# EAGLE design 0_8mm_Layers (EAGLE 9.5.2)
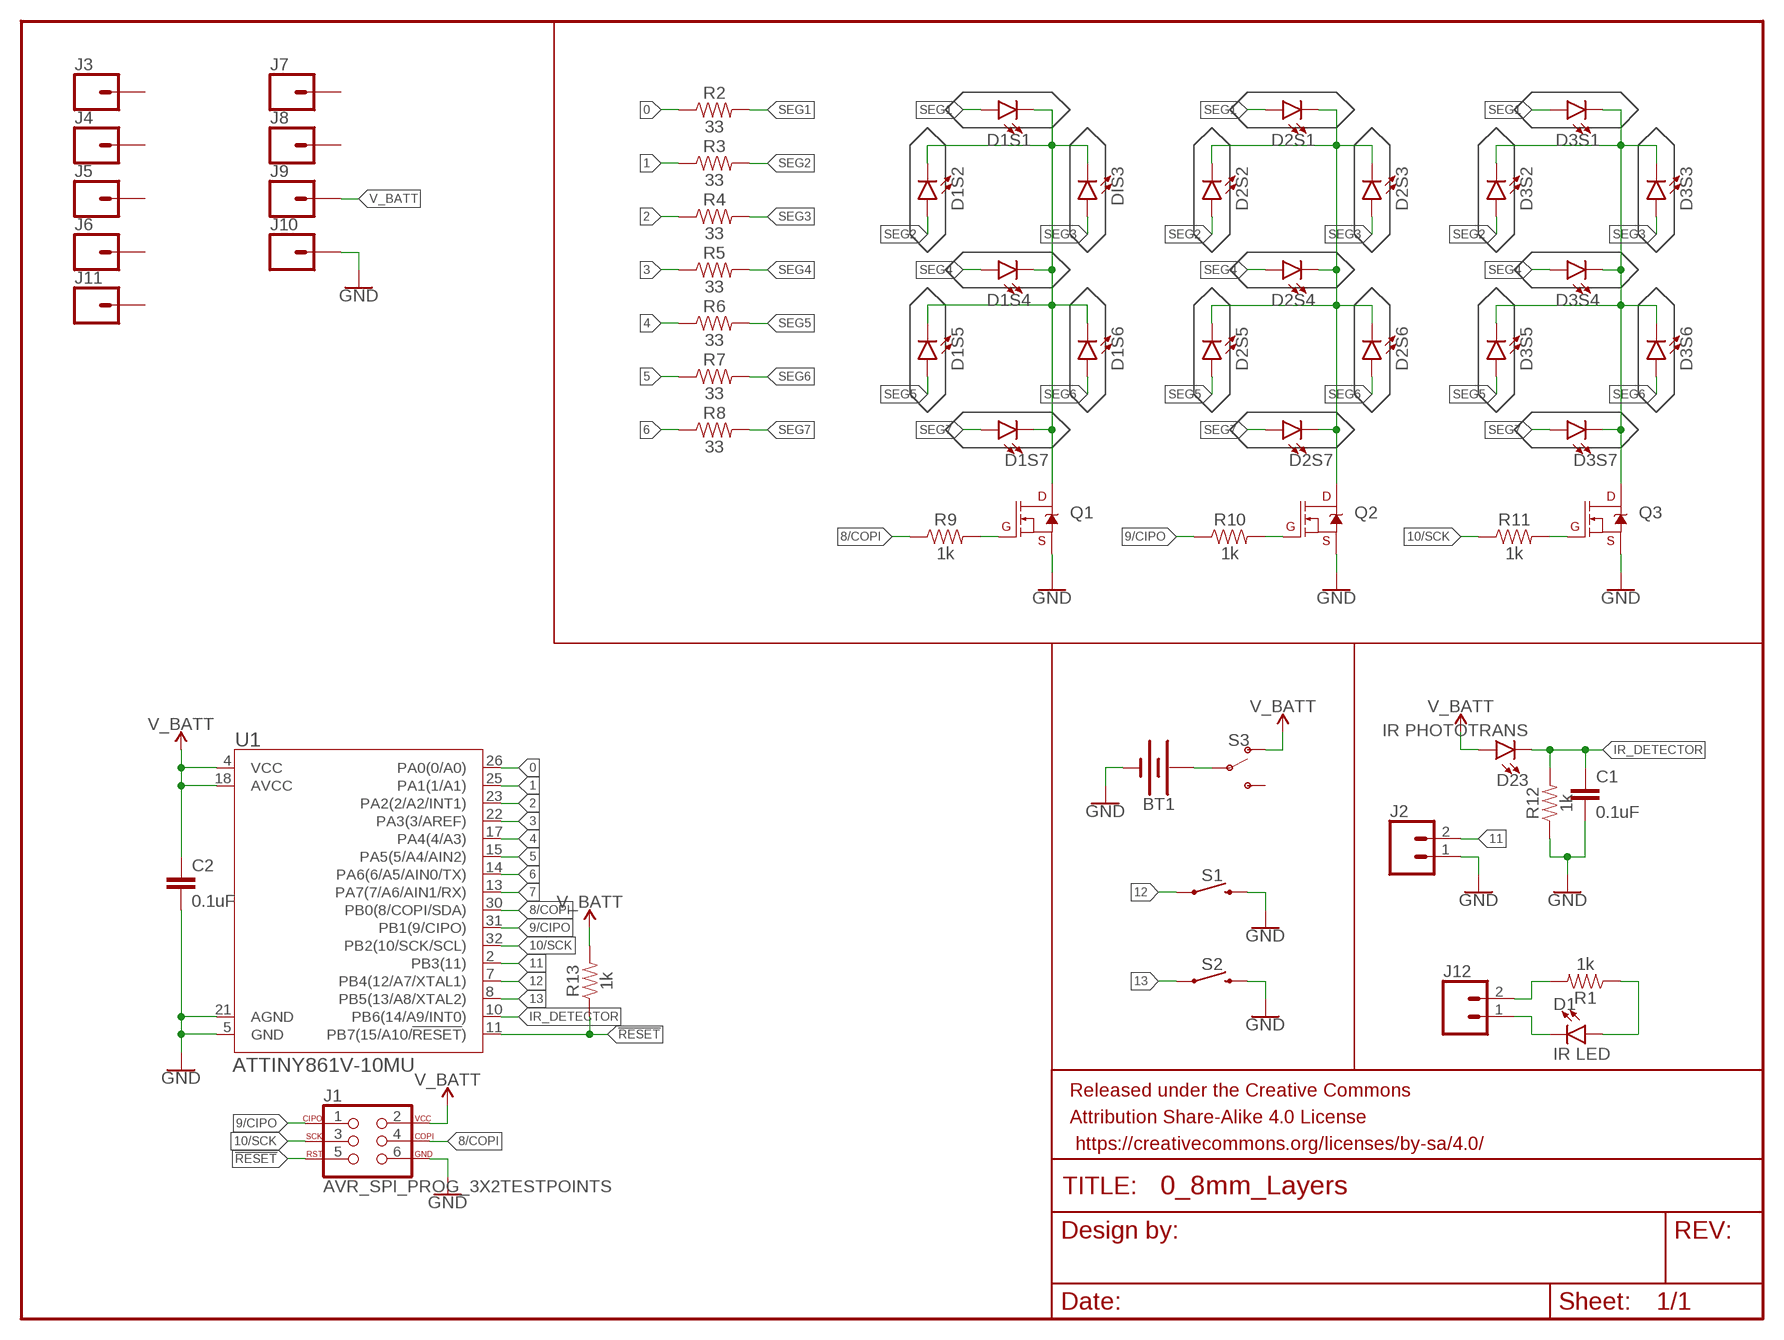
[diagram p0: schematic, sheet 1]

## Parts
BT1  BATTERY-20MM_SMD_4LEGS_OVERPASTE_INNER  [BATTCON_20MM_4LEGS_OVERPASTE_INNER]
C1  0.1uF  0.1UF-0603-25V-(+80/-20%)  [0603]
C2  0.1uF  0.1UF-0603-25V-(+80/-20%)  [0603]
D1  IR LED  LED-IR0603  [LED-0603]
D1S1  LED0603  [LED-0603]
D1S2  LED0603  [LED-0603]
D1S4  LED0603  [LED-0603]
D1S5  LED0603  [LED-0603]
D1S6  LED0603  [LED-0603]
D1S7  LED0603  [LED-0603]
D2S1  LED0603  [LED-0603]
D2S2  LED0603  [LED-0603]
D2S3  LED0603  [LED-0603]
D2S4  LED0603  [LED-0603]
D2S5  LED0603  [LED-0603]
D2S6  LED0603  [LED-0603]
D2S7  LED0603  [LED-0603]
D3S1  LED0603  [LED-0603]
D3S2  LED0603  [LED-0603]
D3S3  LED0603  [LED-0603]
D3S4  LED0603  [LED-0603]
D3S5  LED0603  [LED-0603]
D3S6  LED0603  [LED-0603]
D3S7  LED0603  [LED-0603]
D23  IR PHOTOTRANS  LED-IR0603  [LED-0603]
DIS3  LED0603  [LED-0603]
FRAME1  FRAME-LETTER  [CREATIVE_COMMONS]
J1  AVR_SPI_PROG_3X2TESTPOINTS  [2X3_TEST_POINTS]
J2  CONN_02  [1X02]
J3  CONN_01  [1X01]
J4  CONN_01  [1X01]
J5  CONN_01  [1X01]
J6  CONN_01  [1X01]
J7  CONN_01  [1X01]
J8  CONN_01  [1X01]
J9  CONN_01  [1X01]
J10  CONN_01  [1X01]
J11  CONN_01  [1X01]
J12  CONN_02  [1X02]
Q1  220mA/50V/3.5Ω  MOSFET-NCH-BSS138  [SOT23-3]
Q2  220mA/50V/3.5Ω  MOSFET-NCH-BSS138  [SOT23-3]
Q3  220mA/50V/3.5Ω  MOSFET-NCH-BSS138  [SOT23-3]
R1  1k  1KOHM-0603-1/10W-1%  [0603]
R2  33  33OHM-0603-1/10W-1%  [0603]
R3  33  33OHM-0603-1/10W-1%  [0603]
R4  33  33OHM-0603-1/10W-1%  [0603]
R5  33  33OHM-0603-1/10W-1%  [0603]
R6  33  33OHM-0603-1/10W-1%  [0603]
R7  33  33OHM-0603-1/10W-1%  [0603]
R8  33  33OHM-0603-1/10W-1%  [0603]
R9  1k  1KOHM-0603-1/10W-1%  [0603]
R10  1k  1KOHM-0603-1/10W-1%  [0603]
R11  1k  1KOHM-0603-1/10W-1%  [0603]
R12  1k  1KOHM-0603-1/10W-1%  [0603]
R13  1k  1KOHM-0603-1/10W-1%  [0603]
S1  MOMENTARY-SWITCH-SPST-SMD-5.2MM-TALL  [TACTILE_SWITCH_SMD_5.2MM]
S2  MOMENTARY-SWITCH-SPST-SMD-5.2MM-TALL  [TACTILE_SWITCH_SMD_5.2MM]
S3  SWITCH-SPDT-SMD-RIGHT-ANGLE  [SWITCH_SPST_SMD_A]
U1  ATTINY861V-10MU  [32M1-A_ATM]

## Nets
0: R2.1 U1.26(PA0(0/A0))
1: R3.1 U1.25(PA1(1/A1))
2: R4.1 U1.23(PA2(2/A2/INT1))
3: R5.1 U1.22(PA3(3/AREF))
4: R6.1 U1.17(PA4(4/A3))
5: R7.1 U1.15(PA5(5/A4/AIN2))
6: R8.1 U1.14(PA6(6/A5/AIN0/TX))
7: U1.13(PA7(7/A6/AIN1/RX))
8/COPI: J1.4 R9.1 U1.30(PB0(8/COPI/SDA))
9/CIPO: J1.1 R10.1 U1.31(PB1(9/CIPO))
10/SCK: J1.3 R11.1 U1.32(PB2(10/SCK/SCL))
11: J2.2 U1.2(PB3(11))
12: S1.1 U1.7(PB4(12/A7/XTAL1))
13: S2.1 U1.8(PB5(13/A8/XTAL2))
!RESET: J1.5 R13.1 U1.11(PB7(15/A10/!RESET!))
GND: BT1.2(-) C1.2 C2.2 J1.6 J2.1 J10.1 Q1.2(S) Q2.2(S) Q3.2(S) R12.1 S1.3 S2.3 U1.5(GND) U1.21(AGND)
IR_DETECTOR: C1.1 D23.C R12.2 U1.10(PB6(14/A9/INT0))
N$4: D1S1.C D1S2.C D1S4.C D1S5.C D1S6.C D1S7.C DIS3.C Q1.3(D)
N$6: BT1.1(+) S3.2(P)
N$8: Q2.1(G) R10.2
N$9: Q1.1(G) R9.2
N$11: D2S1.C D2S2.C D2S3.C D2S4.C D2S5.C D2S6.C D2S7.C Q2.3(D)
N$13: Q3.1(G) R11.2
N$14: D3S1.C D3S2.C D3S3.C D3S4.C D3S5.C D3S6.C D3S7.C Q3.3(D)
N$44: J12.2 R1.2
N$45: D1.A R1.1
N$46: D1.C J12.1
SEG1: D1S1.A D2S1.A D3S1.A R2.2
SEG2: D1S2.A D2S2.A D3S2.A R3.2
SEG3: D2S3.A D3S3.A DIS3.A R4.2
SEG4: D1S4.A D2S4.A D3S4.A R5.2
SEG5: D1S5.A D2S5.A D3S5.A R6.2
SEG6: D1S6.A D2S6.A D3S6.A R7.2
SEG7: D1S7.A D2S7.A D3S7.A R8.2
V_BATT: C2.1 D23.A J1.2 J9.1 R13.2 S3.1(O) U1.4(VCC) U1.18(AVCC)
Unconnected: J3.1 J4.1 J5.1 J6.1 J7.1 J8.1 J11.1 S3.3(S)

## Library data of the parts
BT1 = SparkFun-Batteries:BATTERY: Battery - Single Cell A variety of battery chemistries, sizes, and footprints. Device List: 20MM_PTH - Coin Cell Battery Holder - 20mm (PTH) <https://www.sparkfun.com/products/783> 20MM_PTH_KIT- Coin Cell battery Holder - 20 mm (PTH) <http://www.sparkfun.com/products/783>kit version with special mask 6.8MM_PTH - Coin Cell Battery Holder - 6.8MM(SMD) <https://www.digikey.com/product-detail/en/seiko-instruments/MS621FE-FL11E/728-1057-ND/1889208?WT.srch=1&gclid=CNOQ5a6LzdQCFZS2wAodXCkE0g> 12MM_SMD - Coin Cell Battery Holder - 12mm (SMD) <https://www.sparkfun.com/products/10592> 12MM_PTH - Coin Cell Battery Holder - 12mm (PTH) <https://www.sparkfun.com/products/7948> 20MM_SMD - 20mm Coin Cell Battery Holder (SMD) (2 legs) Used on the Big Time Watch Kit <https://www.sparkfun.com/products/11734> 20MM_SMD_4LEGS - Coin Cell Battery Holder - 20mm (SMD) <https://www.sparkfun.com/products/11892> 20MM_SMD_4LEGS_OVERPASTE - Coin Cell Battery Holder - 20mm (SMD) <https://www.sparkfun.com/products/11892> (Over-paste on the legs) 24.5MM_PTH - Coin Cell Battery Holder - 24.5mm (PTH) <https://www.sparkfun.com/products/8863> 9V - 9V Battery Holder - PC Mount Used on the SparkFun SparkPunk Sound Kit <https://www.sparkfun.com/products/11177> and SparkFun SparkPunk Sequencer Kit <https://www.sparkfun.com/products/12707> 18650 - Battery Holder - 18650 (PTH) <https://www.sparkfun.com/products/13113> AA - Battery Holder - 1xAA (PTH) <https://www.sparkfun.com/products/7949> AAA - Battery Holder - 1xAAA (PTH) <https://www.sparkfun.com/products/12718> AA_KIT - Battery Holder - 1xAA (PTH) <https://www.sparkfun.com/products/7949> Special kit package - pads only have exposed copper on one side of the board. AAA_KIT - Battery Holder - 1xAAA (PTH) <https://www.sparkfun.com/products/12718> Special kit package - pads only have exposed copper on one side of the board.
C1 C2 = SparkFun-Capacitors:0.1UF: 0.1µF ceramic capacitors A capacitor is a passive two-terminal electrical component used to store electrical energy temporarily in an electric field.; PROD_ID: CAP-00810
D1 D23 = SparkFun-LED:LED-IR: Infrared LED (IR) Wavelength: 940nm Packages: TSAL6100 LTE302 - Side firing. Check SparkFun-Sensors.lbr for the receiver SparkFun Products: ZX Distance and Gesture Sensor <[https://www.sparkfun.com/products/12780]> Infrared Emitters and Detectors <https://www.sparkfun.com/products/241>; PROD_ID: DIO-14125
D1S1 D1S2 D1S4-D1S7 D2S1-D2S7 D3S1-D3S7 DIS3 = SparkFun-LED:LED: LED (Generic) Standard schematic elements and footprints for 5mm, 3mm, 1206, and 0603 sized LEDs. Generic LEDs with no color specified.
FRAME1 = SparkFun-Aesthetics:FRAME-LETTER: Schematic Frame - Letter Standard 8.5x11 US Letter frame
J1 = SparkFun-Connectors:AVR_SPI_PROG_3X2: AVR ISP 6 Pin This is the reduced ISP connector for AVR programming. Common on Arduino. This footprint will take up less PCB space and can be used with a 10-pin to 6-pin adapter such as SKU: BOB-08508 **Special note about "TEST_POINT" package. The stop mask is on the top side, so if you want your programming test points to be on the bottom of your board, make sure to place this package on the bottom side of the board. This also ensure that the orientation to program from the bottom side will be correct. SparkFun Products: SparkFun ISP Pogo Adapter <https://www.sparkfun.com/products/11591> - NS Tiny AVR Programmer <https://www.sparkfun.com/products/11801> -PTH
J2 J12 = SparkFun-Connectors:CONN_02: Multi connection point. Often used as Generic Header-pin footprint for 0.1 inch spaced/style header connections On any of the 0.1 inch spaced packages, you can populate with these: Break Away Headers - Straight <https://www.sparkfun.com/products/116> (PRT-00116) Break Away Male Headers - Right Angle <https://www.sparkfun.com/products/553> (PRT-00553) Female Headers <https://www.sparkfun.com/products/115> (PRT-00115) Break Away Headers - Machine Pin <https://www.sparkfun.com/products/117> (PRT-00117) Break Away Female Headers - Swiss Machine Pin <https://www.sparkfun.com/products/743> (PRT-00743) For SCREWTERMINALS and SPRING TERMINALS visit here: Screw Terimnals on SparkFun.com <https://www.sparkfun.com/search/results?term=Screw+Terminals> (5mm/3.5mm/2.54mm spacing) This device is also useful as a general connection point to wire up your design to another part of your project. Our various solder wires solder well into these plated through hole pads. Hook-Up Wire - Assortment (Stranded, 22 AWG) <https://www.sparkfun.com/products/11375> (PRT-11375) Hook-Up Wire - Assortment (Solid Core, 22 AWG) <https://www.sparkfun.com/products/11367> (PRT-11367) View the entire wire category on our website here <https://www.sparkfun.com/categories/141> Special notes: Molex polarized connector foot print use with: PRT-08233 with associated crimp pins and housings. 2.54_SCREWTERM for use with PRT-10571. 3.5mm Screw Terminal footprints for PRT-08084 5mm Screw Terminal footprints for use with PRT-08432
J3-J11 = SparkFun-Connectors:CONN_01: Single connection point. Often used as Generic Header-pin footprint for 0.1 inch spaced/style header connections On any of the 0.1 inch spaced packages, you can populate with these: Break Away Headers - Straight <https://www.sparkfun.com/products/116> (PRT-00116) Break Away Male Headers - Right Angle <https://www.sparkfun.com/products/553> (PRT-00553) Female Headers <https://www.sparkfun.com/products/115> (PRT-00115) Break Away Headers - Machine Pin <https://www.sparkfun.com/products/117> (PRT-00117) Break Away Female Headers - Swiss Machine Pin <https://www.sparkfun.com/products/743> (PRT-00743) This device is also useful as a general connection point to wire up your design to another part of your project. Our various solder wires solder well into these plated through hole pads. Hook-Up Wire - Assortment (Stranded, 22 AWG) <https://www.sparkfun.com/products/11375> (PRT-11375) Hook-Up Wire - Assortment (Solid Core, 22 AWG) <https://www.sparkfun.com/products/11367> (PRT-11367) View the entire wire category on our website here <https://www.sparkfun.com/categories/141> Special notes: SMTSO-256-ET is a "flush mount" nut for a 4-40 screw. We mostly use this on specialty testbeds; it is a nice way to connect hardware to your PCB at an adjustable hieght. Also note, the SNAP packages are for using a snappable style connector. We sell a baggie of snaps and they are also used on two LilyPad designs: Snap Assortment - 30 pack (male and female) <https://www.sparkfun.com/products/11347> (DEV-11347) LilyPad Arduino SimpleSnap <https://www.sparkfun.com/products/10941> (DEV-10941) LilyPad SimpleSnap Protoboard <https://www.sparkfun.com/products/10940> (DEV-10940)
Q1-Q3 = SparkFun-DiscreteSemi:MOSFET-NCH: N-channel MOSFETs Voltage controlled devices that allow control of high current outputs. SparkFun Products: SparkFun OpenScale <https://www.sparkfun.com/products/13261> SparkFun Digital Sandbox <https://www.sparkfun.com/products/12651> SparkFun Monster Moto Shield <https://www.sparkfun.com/products/10182> SparkFun MOSFET Power Controller <https://www.sparkfun.com/products/11214>; PROD_ID: TRANS-00830
R1 R9-R13 = SparkFun-Resistors:1KOHM: 1kΩ resistor A resistor is a passive two-terminal electrical component that implements electrical resistance as a circuit element. Resistors act to reduce current flow, and, at the same time, act to lower voltage levels within circuits. - Wikipedia; PROD_ID: RES-07856
R2-R8 = SparkFun-Resistors:33OHM: 33Ω resistor A resistor is a passive two-terminal electrical component that implements electrical resistance as a circuit element. Resistors act to reduce current flow, and, at the same time, act to lower voltage levels within circuits. - Wikipedia; PROD_ID: RES-08270
S1 S2 = SparkFun-Switches:MOMENTARY-SWITCH-SPST: Momentary Switch (Pushbutton) - SPST Normally-open (NO) SPST momentary switches (buttons, pushbuttons). Variants PTH-12MM - 12mm square, through-hole Momentary Pushbutton Switch - 12mm Square <https://www.sparkfun.com/products/9190> (COM-09190) PTH-6.0MM, PTH-6.0MM-KIT - 6.0mm square, through-hole Mini Pushbutton Switch <https://www.sparkfun.com/products/97> (COM-00097) KIT package intended for soldering kit's - only one side of pads' copper is exposed. PTH-RIGHT-ANGLE-KIT - Right-angle, through-hole Right Angle Tactile Button <https://www.sparkfun.com/products/10791> - Used on SparkFun BigTime Watch Kit <https://www.sparkfun.com/products/11734> SMD-12MM - 12mm square, surface-mount Tactile Button - SMD (12mm) <https://www.sparkfun.com/products/12993> (COM-12993) Used on SparkFun PicoBoard <https://www.sparkfun.com/products/11888> SMD-4.5MM - 4.5mm Square Trackball Switch Used on SparkFun Blackberry Trackballer Breakout <https://www.sparkfun.com/products/13169> SMD-4.6MMX2.8MM - 4.60mm x 2.80mm, surface mount Used on SparkFun Pro Micro - RP2040 <https://www.sparkfun.com/products/17717> SMD-5.2MM, SMD-5.2-REDUNDANT - 5.2mm square, surface-mount Mini Pushbutton Switch - SMD <https://www.sparkfun.com/products/8720> (COM-08720) Used on Arduino Pro Mini <https://www.sparkfun.com/products/11114> REDUNDANT package connects both switch circuits together SMD-6.0X3.5MM - 6.0 x 3.5mm, surface mount Momentary Reset Switch SMD <https://www.sparkfun.com/products/8229> (COM-08229) SMD-6.2MM-TALL - 6.2mm square, surface mount Tactile Button - SMD (6mm) <https://www.sparkfun.com/products/12992> Used on SparkFun Digital Sandbox <https://www.sparkfun.com/products/12651> SMD-RIGHT-ANGLE - Right-angle, surface mount Used on SparkFun Block for Intel® Edison - Arduino <https://www.sparkfun.com/products/13036>; PROD_ID: SWCH-14139
S3 = SparkFun-Switches:SWITCH-SPDT: Single Pole, Double Throw (SPDT) Switch Single-pole, double-throw (SPDT) switch. Variant Overview SMD-AYZ0202 Surface Mount DPDT Switch <https://www.sparkfun.com/products/597> (COM-00597) Used on e.g. LilyPad Arduino USB - ATmega32U4 Board <https://www.sparkfun.com/products/12049> PTH-11.6X4.0MM SPDT Mini Power Switch <https://www.sparkfun.com/products/102> (COM-00102) Used on e.g. SparkFun Simon Says - Through-Hole Soldering Kit <https://www.sparkfun.com/products/10547> (KIT-10547) PTH-11.6X4.0MM-KIT KIT version of SPDT Mini Power Switch - Simplifies soldering by removing tStop of switch pins - only one side can be soldered. PTH-11.6X4.0MM-LOCK LOCK version of SPDT Mini Power Switch - Offset pins hold switch in place for easier soldering. SMD-RIGHT-ANGLE Surface Mount Right Angle Switch <https://www.sparkfun.com/products/10860> (COM-10860) Used on e.g. SparkFun ESP8266 Thing <https://www.sparkfun.com/products/13231>; PROD_ID: SWCH-10651; SF_SKU: COM-10860
U1 = Melodica:ATTINY861V-10MU; COPYRIGHT: Copyright (C) 2021 Ultra Librarian. All rights reserved.; DIGI-KEY_PART_NUMBER_1: ATTINY861V-10MU-ND; DIGI-KEY_PART_NUMBER_2: 2156-ATTINY861V-10MU-ND; MANUFACTURER_PART_NUMBER: ATTINY861V-10MU; MFR_NAME: Microchip

## Board
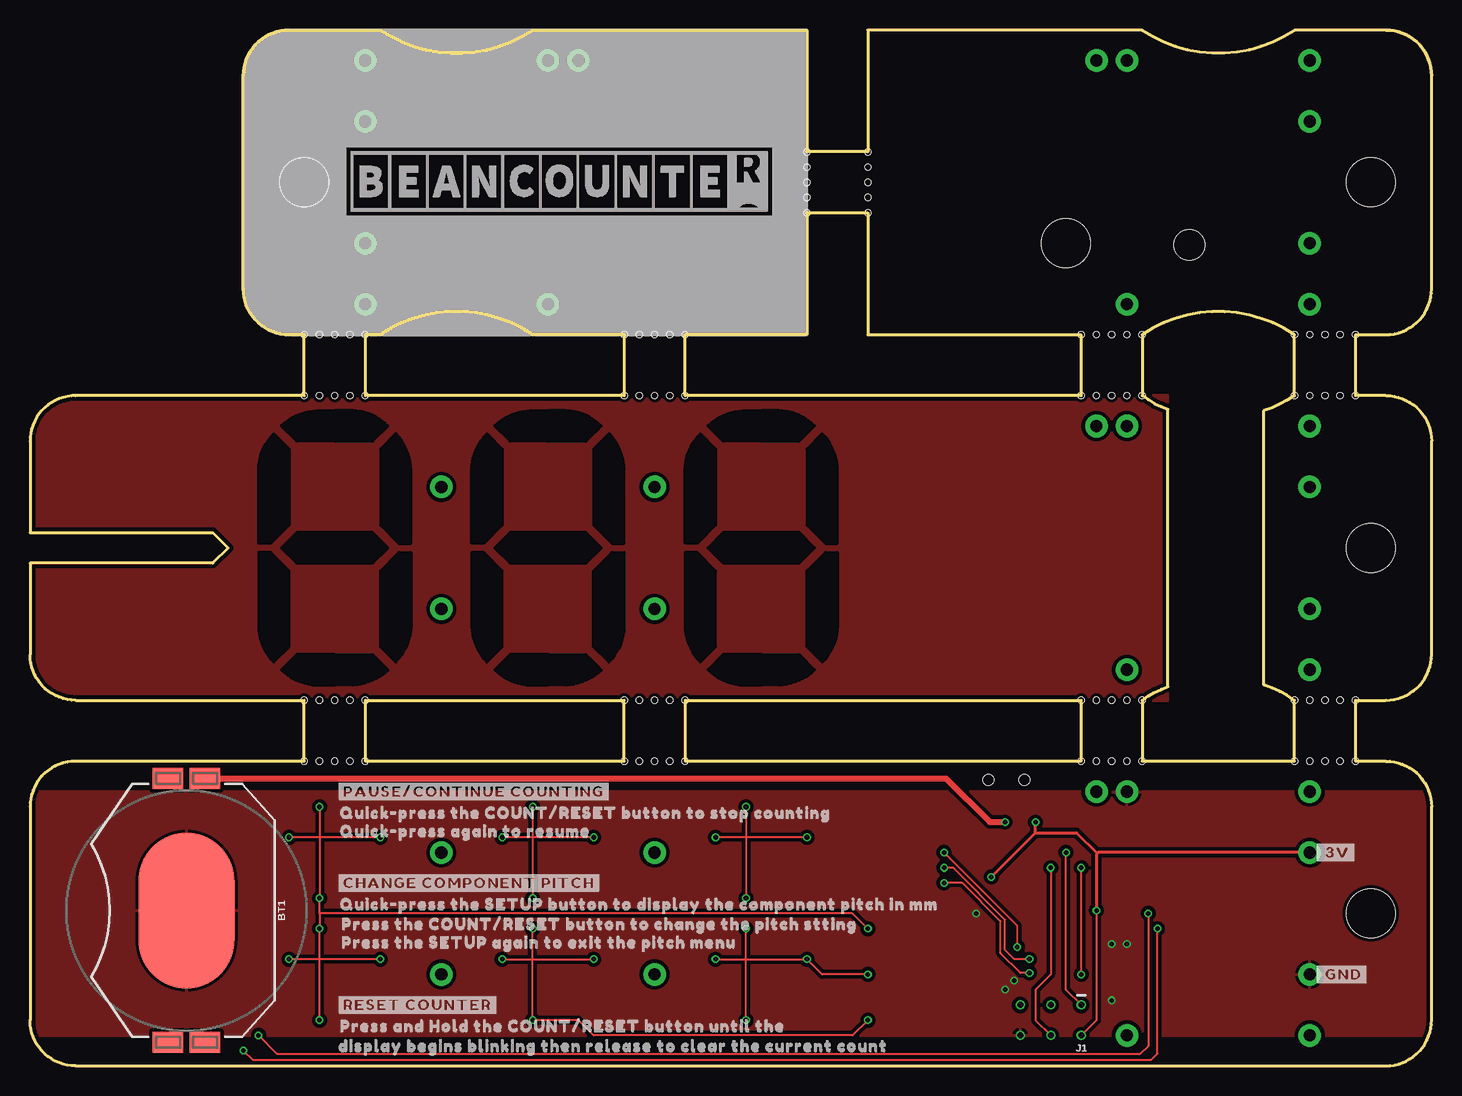
[diagram p1: board, top side]
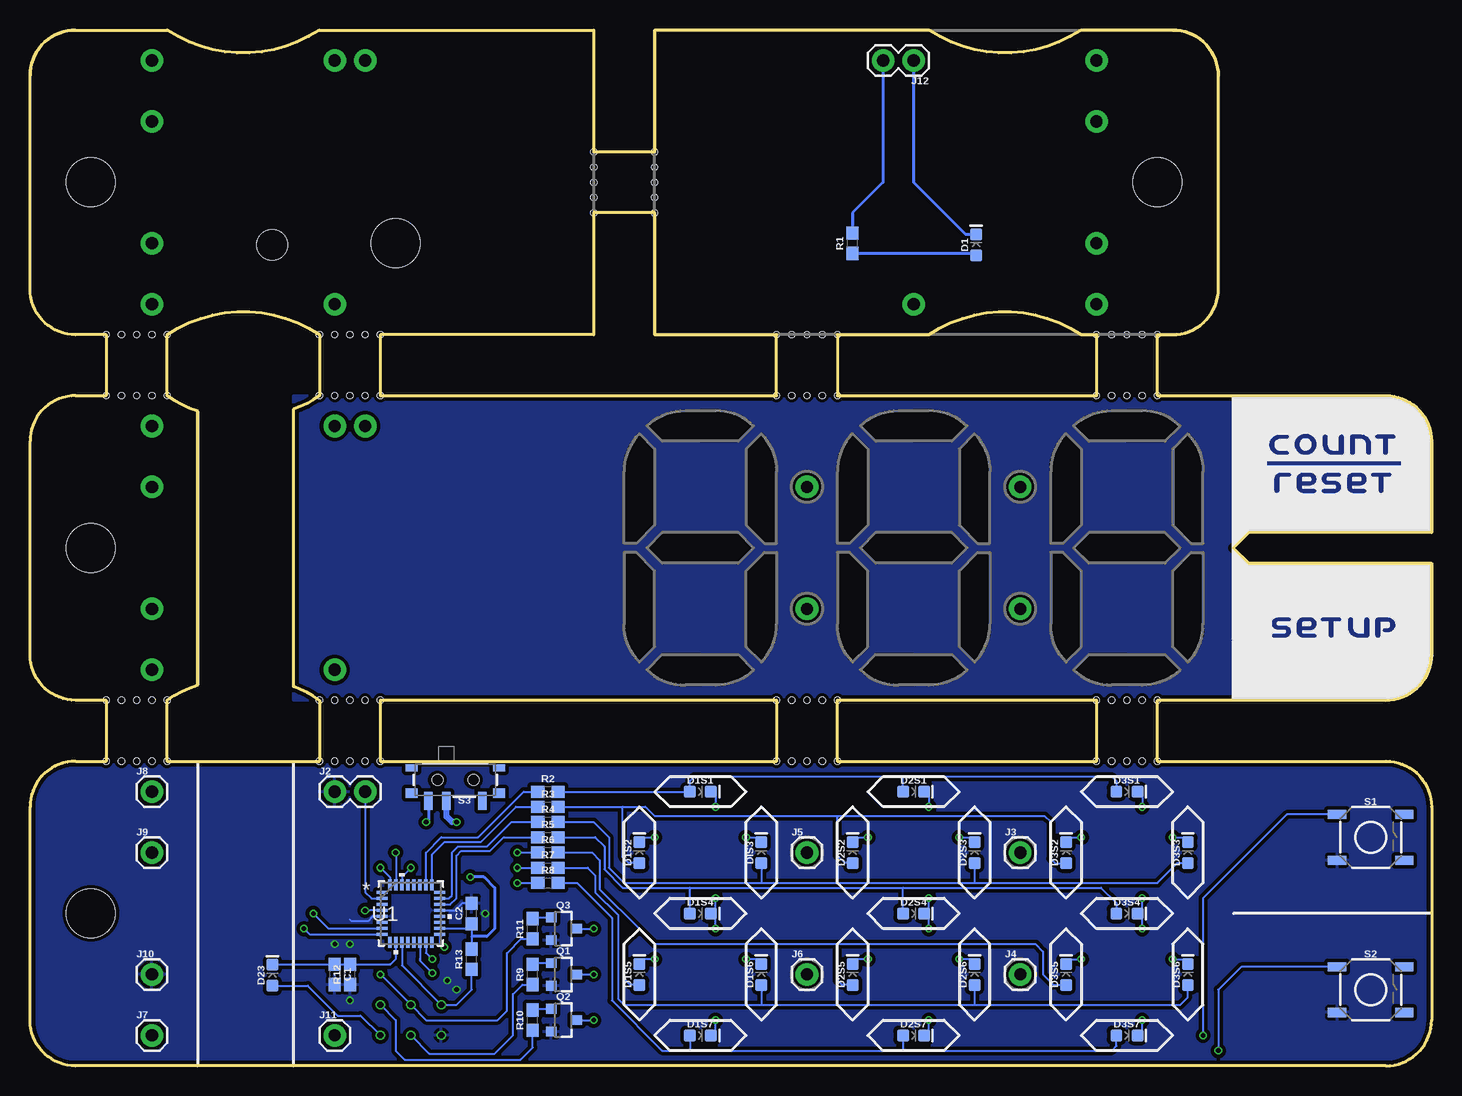
[diagram p2: board, bottom side, seen from below]

Size 116.84 x 86.36 mm. Coordinates in mm from the lower left corner, seen from the top.
Outline: 113.03,86.36 arc-90 116.84,82.55
Outline: 113.03,60.96 arc90 116.84,64.77
Outline: 116.84,82.55 arc90 113.03,86.36
Outline: 113.03,86.36 105.41,86.36 arc-67 92.71,86.36 69.85,86.36 69.85,76.2 64.77,76.2 64.77,86.36 41.91,86.36 arc-67 29.21,86.36 21.59,86.36
Outline: 113.03,60.96 110.49,60.96 110.49,55.88 113.03,55.88 arc-90 116.84,52.07 116.84,34.29 arc-90 113.03,30.48 110.49,30.48 110.49,25.4 113.03,25.4 arc-90 116.84,21.59 116.84,3.81 arc-90 113.03,0 3.81,0 arc-90 0,3.81 0,21.59 arc-90 3.81,25.4 22.86,25.4 22.86,30.48 3.81,30.48 arc-90 0,34.29 0,41.91 15.24,41.91 16.51,43.18 15.24,44.45 0,44.45 0,52.07 arc-90 3.81,55.88 22.86,55.88 22.86,60.96 21.59,60.96
Outline: 113.03,60.96 arc90 116.84,64.77
Outline: 116.84,64.77 116.84,82.55
Outline: 21.59,86.36 arc90 17.78,82.55
Outline: 21.59,60.96 arc-90 17.78,64.77
Outline: 17.78,82.55 arc-90 21.59,86.36
Outline: 21.59,60.96 arc-90 17.78,64.77
Outline: 17.78,64.77 17.78,82.55
Outline: 105.41,25.4 92.71,25.4 92.71,30.48 arc-16 94.87,31.62 94.87,54.74 arc-16 92.71,55.88 92.71,60.96 arc-67 105.41,60.96 105.41,55.88 arc-16 102.87,54.61 102.87,31.75 arc-16 105.41,30.48 105.41,25.4
Outline: 87.63,25.4 54.61,25.4 54.61,30.48 87.63,30.48 87.63,25.4
Outline: 49.53,25.4 27.94,25.4 27.94,30.48 49.53,30.48 49.53,25.4
Outline: 87.63,55.88 54.61,55.88 54.61,60.96 64.77,60.96 64.77,71.12 69.85,71.12 69.85,60.96 87.63,60.96 87.63,55.88
Outline: 49.53,55.88 27.94,55.88 27.94,60.96 29.21,60.96 arc-67 41.91,60.96 49.53,60.96 49.53,55.88
Copper layers (1*16): Top 0.035mm / dielectric 1.5mm / Bottom 0.035mm
Design rules "SparkFun-2-Layer-Minimum-JLCPCB": minimum track width 5mil, minimum drill 0.3mm, track to track 5mil, track to pad 5mil, pad to pad 5mil, via to via 5mil, smd to smd 5mil, copper to edge 7mil, drill to drill 7mil, minimum pad ring 5mil, minimum via ring 5mil, stop-mask expansion 4mil, vias tented up to drill 25mil, thermal gap 10mil
Holes 4.06 mm at 111.76,12.7 111.76,43.18 111.76,73.66 22.86,73.66 86.36,68.58
Holes 2.54 mm at 96.65,68.45
Holes 0.51 mm at 106.68,60.96 105.41,60.96 107.95,60.96 109.22,60.96 110.49,60.96 91.44,60.96 90.17,60.96 92.71,60.96 87.63,60.96 88.9,60.96 106.68,55.88 105.41,55.88 107.95,55.88 109.22,55.88 110.49,55.88 91.44,55.88 90.17,55.88 92.71,55.88 87.63,55.88 88.9,55.88 52.07,55.88 50.8,55.88 53.34,55.88 54.61,55.88 49.53,55.88 25.4,60.96 24.13,60.96 26.67,60.96 27.94,60.96 22.86,60.96 64.77,73.66 64.77,74.93 64.77,72.39 64.77,71.12 64.77,76.2 69.85,73.66 69.85,74.93 69.85,72.39 69.85,71.12 69.85,76.2 106.68,30.48 105.41,30.48 107.95,30.48 109.22,30.48 110.49,30.48 91.44,30.48 90.17,30.48 92.71,30.48 87.63,30.48 88.9,30.48 52.07,30.48 50.8,30.48 53.34,30.48 54.61,30.48 49.53,30.48 25.4,30.48 24.13,30.48 26.67,30.48 27.94,30.48 22.86,30.48 106.68,25.4 105.41,25.4 107.95,25.4 109.22,25.4 110.49,25.4 91.44,25.4 90.17,25.4 92.71,25.4 87.63,25.4 88.9,25.4 52.07,25.4 50.8,25.4 53.34,25.4 54.61,25.4 49.53,25.4 25.4,25.4 24.13,25.4 26.67,25.4 27.94,25.4 22.86,25.4 52.07,60.96 50.8,60.96 53.34,60.96 54.61,60.96 49.53,60.96 25.4,55.88 24.13,55.88 26.67,55.88 27.94,55.88 22.86,55.88

### Footprints (pad centres in the part's own frame; a part is rotated, then mirrored left to right if it is on the bottom)
BATTCON_20MM_4LEGS_OVERPASTE_INNER = smd 1.778 x 2.54: 1 -11,1.55; 3 11,1.55; P$1 -11,-1.55; P$2 11,-1.55 | smd 13 x 8: 2 0,0
0603 = smd 1.1 x 1: 1 -0.85,0; 2 0.85,0
LED-0603 = smd 1 x 1: A -0.877,0; C 0.877,0
2X3_TEST_POINTS = drill 0.508: 1 -2.54,-1.27; 2 -2.54,1.27; 3 0,-1.27; 4 0,1.27; 5 2.54,-1.27; 6 2.54,1.27
1X02 = drill 1.016 pad 1.88: 1 0,0; 2 2.54,0
1X01 = drill 1.016 pad 1.88: 1 0,0
SOT23-3 = smd 0.8 x 0.9: 1 -0.95,-1; 2 0.95,-1; 3 0,1.1
TACTILE_SWITCH_SMD_5.2MM = smd 1.524 x 0.762: 1 -2.794,1.905; 2 2.794,1.905; 3 -2.794,-1.905; 4 2.794,-1.905
SWITCH_SPST_SMD_A = smd 0.7 x 1.5: 1 -2.25,-1.75; 2 -0.75,-1.75; 3 2.25,-1.75 | smd 1 x 0.6: GND1 -3.65,1; GND3 3.65,1 | smd 1 x 0.8: GND2 -3.65,-1.1; GND4 3.65,-1.1 | hole 0.9: -1.5,0; 1.5,0
32M1-A_ATM = smd 0.914 x 0.254: 1 -2.4,1.75; 2 -2.4,1.25; 3 -2.4,0.75; 4 -2.4,0.25; 5 -2.4,-0.25; 6 -2.4,-0.75; 7 -2.4,-1.25; 8 -2.4,-1.75; 17 2.4,-1.75; 18 2.4,-1.25; 19 2.4,-0.75; 20 2.4,-0.25; 21 2.4,0.25; 22 2.4,0.75; 23 2.4,1.25; 24 2.4,1.75 | smd 0.254 x 0.914: 9 -1.75,-2.4; 10 -1.25,-2.4; 11 -0.75,-2.4; 12 -0.25,-2.4; 13 0.25,-2.4; 14 0.75,-2.4; 15 1.25,-2.4; 16 1.75,-2.4; 25 1.75,2.4; 26 1.25,2.4; 27 0.75,2.4; 28 0.25,2.4; 29 -0.25,2.4; 30 -0.75,2.4; 31 -1.25,2.4; 32 -1.75,2.4

### Placement (x,y rotation side)
BT1  13.05,12.96 270 top
C1  91.44,7.62 270 bottom
C2  80.01,12.7 90 bottom
D1  37.97,68.45 90 bottom
D1S1  60.96,22.86 0 bottom
D1S2  66.04,17.78 90 bottom
D1S4  60.96,12.7 0 bottom
D1S5  66.04,7.62 90 bottom
D1S6  55.88,7.62 90 bottom
D1S7  60.96,2.54 0 bottom
D2S1  43.18,22.86 0 bottom
D2S2  48.26,17.78 90 bottom
D2S3  38.1,17.78 90 bottom
D2S4  43.18,12.7 0 bottom
D2S5  48.26,7.62 90 bottom
D2S6  38.1,7.62 90 bottom
D2S7  43.18,2.54 0 bottom
D3S1  25.4,22.86 0 bottom
D3S2  30.48,17.78 90 bottom
D3S3  20.32,17.78 90 bottom
D3S4  25.4,12.7 0 bottom
D3S5  30.48,7.62 90 bottom
D3S6  20.32,7.62 90 bottom
D3S7  25.4,2.54 0 bottom
D23  96.63,7.56 90 bottom
DIS3  55.88,17.78 90 bottom
FRAME1  81.24,-12.17 0 bottom  (outside the outline)
J1  85.09,3.81 180 top
J2  91.44,22.86 0 bottom
J3  34.29,17.78 0 bottom
J4  34.29,7.62 0 bottom
J5  52.07,17.78 0 bottom
J6  52.07,7.62 0 bottom
J7  106.68,2.54 0 bottom
J8  106.68,22.86 0 bottom
J9  106.68,17.78 0 bottom
J10  106.68,7.62 0 bottom
J11  91.44,2.54 0 bottom
J12  43.18,83.82 180 bottom
Q1  72.39,7.62 270 bottom
Q2  72.39,3.81 270 bottom
Q3  72.39,11.43 270 bottom
R1  48.26,68.58 90 bottom
R2  73.66,22.86 0 bottom
R3  73.66,21.59 0 bottom
R4  73.66,20.32 0 bottom
R5  73.66,19.05 0 bottom
R6  73.66,17.78 0 bottom
R7  73.66,16.51 0 bottom
R8  73.66,15.24 0 bottom
R9  74.93,7.62 90 bottom
R10  74.93,3.81 90 bottom
R11  74.93,11.43 90 bottom
R12  90.17,7.62 90 bottom
R13  80.01,8.89 90 bottom
S1  5.08,19.05 0 bottom
S2  5.08,6.35 0 bottom
S3  81.38,23.83 0 bottom
U1  85.09,12.7 0 bottom
U$1  [#COUNT#0]  8.13,51.82 0 bottom
U$2  [#RESET#0]  8.13,48.64 0 bottom
U$3  [#SETUP#0]  8.13,36.58 0 bottom
U$4  [LOGO#SVG0]  26.67,71.12 0 top
U$5  [TAPE0603#SVG0]  132.08,0.38 0 bottom  (outside the outline)
U$6  [#_3V#0]  106.93,17.78 0 top
U$7  [#_GND#0]  106.93,7.62 0 top
U$8  [#PAUSE#CONTINUE_COUNTING#0]  25.4,22.86 0 top
U$9  [#RESET_COUNTER#0]  25.4,5.08 0 top
U$10  [#CHANGE_COMPONENT_PITCH#0]  25.4,15.24 0 top
U$11  [QUICK#PRESS_THE_COUNT#RESET_BUTTON_TO_STOP_COUNTING0]  25.15,21.08 0 top
U$12  [QUICK#PRESS_AGAIN_TO_RESUME0]  25.15,19.56 0 top
U$13  [PRESS_AND_HOLD_THE_COUNT#RESET_BUTTON_UNTIL_THE0]  25.15,3.3 0 top
U$14  [DISPLAY_BEGINS_BLINKING_THEN_RELEASE_TO_CLEAR_THE_CURRENT_COUNT0]  25.02,1.65 0 top
U$15  [QUICK#PRESS_THE_SETUP_BUTTON_TO_DISPLAY_THE_COMPONENT_PITCH_IN_MM0]  25.15,13.46 0 top
U$16  [PRESS_THE_COUNT#RESET_BUTTON_TO_CHANGE_THE_PITCH_STTING0]  25.27,11.81 0 top
U$17  [PRESS_THE_SETUP_AGAIN_TO_EXIT_THE_PITCH_MENU0]  25.27,10.29 0 top

### Tracks (layer width: path | path; a pad name or v marks a point on that pad's centre or on a via)
0
  Bottom 0.152: U1.26 83.84,17.76 82.55,19.05 79.5,19.05 75.69,22.86 R2.1
1
  Bottom 0.152: U1.25 83.34,17.62 82.3,18.67 79.25,18.67 76.33,21.59 R3.1
2
  Bottom 0.152: U1.23 81.94,13.95 81.66,14.22 81.66,17.78 81.15,18.29 78.74,18.29 76.71,20.32 R4.1
3
  Bottom 0.152: U1.22 81.8,13.45 81.28,13.97 81.28,17.53 80.9,17.91 78.49,17.91 77.34,19.05 R5.1
4  (via drill 0.38)
  Top 0.152: v82.3,9.91 82.3,11.68 v76.2,17.78
  Bottom 0.152: U1.17 82.69,10.3 v82.3,9.91 | v76.2,17.78 R6.1
5  (via drill 0.38)
  Top 0.152: v83.31,8.89 82.04,8.89 81.28,9.65 81.28,12.19 76.96,16.51 v76.2,16.51
  Bottom 0.152: U1.15 83.84,9.42 v83.31,8.89 | v76.2,16.51 R7.1
6  (via drill 0.38)
  Top 0.152: v83.31,7.75 82.55,7.75 80.9,9.4 80.9,12.07 77.72,15.24 v76.2,15.24
  Bottom 0.152: U1.14 84.34,8.9 84.33,8.89 84.33,8.76 v83.31,7.75 | v76.2,15.24 R8.1
8/COPI  (via drill 0.38)
  Top 0.152: v85.09,16.51 85.09,7.62 83.82,6.35 83.82,3.81 J1.4
  Bottom 0.152: v85.09,16.51 85.84,15.76 U1.30 | R9.1 75.78,6.77 76.58,5.97 76.58,2.54 78.11,1.02 83.57,1.02 J1.4
9/CIPO  (via drill 0.38)
  Top 0.152: J1.1 86.36,6.35 v86.36,17.78
  Bottom 0.152: v86.36,17.78 86.34,17.76 U1.31 | J1.1 86.36,3.81 86.36,1.27 85.6,0.51 75.95,0.51 74.93,1.52 R10.1
10/SCK  (via drill 0.38)
  Top 0.152: v87.63,7.62 v87.63,16.51
  Bottom 0.152: v87.63,7.62 J1.3 83.82,3.81 77.85,3.81 77.09,4.57 77.09,9.4 75.91,10.58 R11.1 | v87.63,16.51 86.84,15.72 U1.32
11
  Bottom 0.152: J2.2 88.9,14.48 88.37,13.95 U1.2
12  (via drill 0.38)
  Top 0.152: v19.05,2.54 20.57,1.02 92.58,1.02 93.22,1.65 v93.22,12.7
  Bottom 0.152: S1.1 12.06,20.95 19.05,13.97 v19.05,2.54 | v93.22,12.7 91.97,11.45 U1.7
13  (via drill 0.38)
  Top 0.152: v17.78,1.27 18.54,0.51 93.47,0.51 93.98,1.02 v93.98,11.43 v93.99,11.43
  Bottom 0.152: S2.1 15.88,8.25 17.78,6.35 v17.78,1.27 | v93.99,11.43 93.51,10.95 U1.8
!RESET
  Bottom 0.152: R13.1 80.01,6.35 81.28,5.08 J1.5 85.84,8.37 U1.11
GND  (via drill 0.38)
  Bottom 0.152: U1.21 81.92,12.95 | 81.92,12.95 | U1.5 88.27,12.45 88.65,12.07 90.04,12.07 90.17,12.19 | 81.92,12.95 81.41,12.95 80.77,13.59 80.05,13.59 C2.2
  other vias: 91.44,10.16 90.17,10.16 90.17,5.46 78.87,12.7 82.04,7.11 81.28,6.35
  pour Bottom (isolate 0.305): 116.84,25.4 0,25.4 0,0 116.84,0
  pour Top (isolate 0.305): 116.84,22.86 0,22.86 0,2.54 116.84,2.54
IR_DETECTOR
  Bottom 0.152: D23.C 96.6,8.47 C1.1 R12.2 86.78,8.47 86.34,8.91 U1.10
MASKBTM
  pour Top (isolate 0.305): 94.87,55.88 3.81,55.88 arc90 0,52.07 0,44.45 15.24,44.45 16.51,43.18 15.24,41.91 0,41.91 0,34.29 arc90 3.81,30.48 94.87,30.48
MASKTP
  pour Bottom (isolate 0.305): 94.87,55.88 3.81,55.88 arc90 0,52.07 0,44.45 15.24,44.45 16.51,43.18 15.24,41.91 0,41.91 0,34.29 arc90 3.81,30.48 94.87,30.48
N$4  (via drill 0.38)
  Top 0.152: v59.69,21.59 59.69,19.05 | 59.69,19.05 v59.69,13.97 | v59.69,3.81 59.69,8.89 | 59.69,8.89 v59.69,11.43 | v64.77,19.05 59.69,19.05 | 59.69,19.05 v57.15,19.05 | v57.15,8.89 59.69,8.89 | 59.69,8.89 v64.77,8.89 66.04,7.62 v69.85,7.62
  Bottom 0.152: D1S1.C 59.69,22.86 v59.69,21.59 | v59.69,11.43 59.69,12.7 D1S4.C 59.69,13.09 v59.69,13.97 | D1S7.C 59.69,2.54 v59.69,3.81 | D1S2.C 66.04,19.05 v64.77,19.05 | v57.15,19.05 55.88,19.05 DIS3.C | D1S6.C 55.88,8.89 v57.15,8.89 | v64.77,8.89 66.04,8.89 D1S5.C | Q1.3 v69.85,7.62
N$6  (via drill 0.38)
  Top 0.508: BT1.1 76.37,23.96 80.01,20.32 v81.28,20.32
  Bottom 0.508: v81.28,20.32 81.66,20.32 82.13,20.79 S3.2
N$8
  Bottom 0.152: R10.2 74.83,4.76 Q2.1
N$9
  Bottom 0.152: R9.2 74.83,8.57 Q1.1
N$11  (via drill 0.38)
  Top 0.152: v41.91,21.59 41.91,19.05 | 41.91,19.05 v41.91,13.97 | 41.91,8.89 v41.91,3.81 45.72,3.81 46.99,2.54 68.58,2.54 v69.85,3.81 | 41.91,8.89 v41.91,11.43 | 41.91,8.89 v46.99,8.89 | v46.99,19.05 41.91,19.05 | 41.91,19.05 v39.37,19.05 | v39.37,8.89 41.91,8.89
  Bottom 0.152: D2S1.C 41.91,22.86 v41.91,21.59 | v41.91,11.43 41.91,12.7 D2S4.C 41.91,13.09 v41.91,13.97 | D2S7.C 41.91,2.54 v41.91,3.81 | D2S6.C 38.1,8.89 v39.37,8.89 | v46.99,8.89 48.26,8.89 D2S5.C | D2S2.C 48.26,19.05 v46.99,19.05 | v39.37,19.05 38.1,19.05 D2S3.C | Q2.3 v69.85,3.81
N$13
  Bottom 0.152: R11.2 74.83,12.38 Q3.1
N$14  (via drill 0.38)
  Top 0.152: v24.13,21.59 24.13,19.05 | 24.13,19.05 v24.13,13.97 24.13,12.7 | v24.13,3.81 24.13,8.89 | 24.13,8.89 v24.13,11.43 24.13,12.7 | v29.21,8.89 24.13,8.89 | 24.13,8.89 v21.59,8.89 | v29.21,19.05 24.13,19.05 | 24.13,19.05 v21.59,19.05 | v69.85,11.43 68.58,12.7 24.13,12.7
  Bottom 0.152: D3S1.C 24.13,22.86 v24.13,21.59 | v24.13,11.43 24.13,12.7 D3S4.C 24.13,13.09 v24.13,13.97 | D3S7.C 24.13,2.54 v24.13,3.81 | D3S5.C 30.48,8.89 v29.21,8.89 | v21.59,8.89 20.32,8.89 D3S6.C | D3S2.C 30.48,19.05 v29.21,19.05 | v21.59,19.05 20.32,19.05 D3S3.C | Q3.3 v69.85,11.43
N$19  (via drill 1.02 pad 1.88)
  other vias: 106.68,33.02
N$20  (via drill 1.02 pad 1.88)
  other vias: 106.68,53.34
N$21  (via drill 1.02 pad 1.88)
  other vias: 106.68,48.26
N$22  (via drill 1.02 pad 1.88)
  other vias: 106.68,38.1
N$23  (via drill 1.02 pad 1.88)
  other vias: 88.9,53.34
N$24  (via drill 1.02 pad 1.88)
  other vias: 91.44,53.34
N$25  (via drill 1.02 pad 1.88)
  other vias: 91.44,33.02
N$26  (via drill 1.02 pad 1.88)
  other vias: 34.29,38.1
N$27  (via drill 1.02 pad 1.88)
  other vias: 34.29,48.26
N$28  (via drill 1.02 pad 1.88)
  other vias: 52.07,48.26
N$29  (via drill 1.02 pad 1.88)
  other vias: 52.07,38.1
N$30  (via drill 1.02 pad 1.88)
  other vias: 106.68,63.5
N$31  (via drill 1.02 pad 1.88)
  other vias: 106.68,83.82
N$32  (via drill 1.02 pad 1.88)
  other vias: 106.68,78.74
N$33  (via drill 1.02 pad 1.88)
  other vias: 106.68,68.58
N$34  (via drill 1.02 pad 1.88)
  other vias: 88.9,83.82
N$35  (via drill 1.02 pad 1.88)
  other vias: 91.44,83.82
N$36  (via drill 1.02 pad 1.88)
  other vias: 91.44,63.5
N$37  (via drill 1.02 pad 1.88)
  other vias: 27.94,63.5
N$38  (via drill 1.02 pad 1.88)
  other vias: 27.94,83.82
N$39  (via drill 1.02 pad 1.88)
  other vias: 27.94,78.74
N$40  (via drill 1.02 pad 1.88)
  other vias: 27.94,68.58
N$43  (via drill 1.02 pad 1.88)
  other vias: 43.18,63.5
N$44
  Bottom 0.254: J12.2 45.72,73.66 48.26,71.12 R1.2
N$45
  Bottom 0.254: R1.1 38.13,67.73 D1.A
N$46
  Bottom 0.254: D1.C 38.85,69.33 43.18,73.66 J12.1
N$52
  cutout Top: 60.96,54.61 60.96,52.07 57.78,52.07 56.52,53.34 56.79,53.59 57.02,53.77 57.25,53.92 57.51,54.08 57.76,54.2 58.06,54.33 58.45,54.46 58.78,54.53 59.13,54.58 59.44,54.61
N$53
  cutout Top: 55.88,52.7 57.15,51.44 57.15,45.09 55.63,43.56 54.61,43.56 54.61,49.76 54.64,50.06 54.69,50.42 54.74,50.65 54.79,50.83 54.89,51.13 54.97,51.31 55.09,51.59 55.24,51.87 55.4,52.12 55.63,52.43
N$54
  cutout Top: 60.96,54.61 60.96,52.07 64.14,52.07 65.41,53.34 65.13,53.59 64.9,53.77 64.67,53.92 64.41,54.08 64.16,54.2 63.86,54.33 63.47,54.46 63.14,54.53 62.79,54.58 62.48,54.61
N$55
  cutout Top: 66.04,52.7 64.77,51.44 64.77,45.09 66.29,43.56 67.31,43.56 67.31,49.76 67.28,50.06 67.23,50.42 67.18,50.65 67.13,50.83 67.03,51.13 66.95,51.31 66.83,51.59 66.67,51.87 66.52,52.12 66.29,52.43
N$56
  cutout Top: 60.96,31.75 60.96,34.29 57.78,34.29 56.52,33.02 56.79,32.77 57.02,32.59 57.25,32.44 57.51,32.28 57.76,32.16 58.06,32.03 58.45,31.9 58.78,31.83 59.13,31.78 59.44,31.75
N$57
  cutout Top: 55.88,33.66 57.15,34.92 57.15,41.27 55.63,42.8 54.61,42.8 54.61,36.6 54.64,36.3 54.69,35.94 54.74,35.71 54.79,35.53 54.89,35.23 54.97,35.05 55.09,34.77 55.24,34.49 55.4,34.24 55.63,33.93
N$58
  cutout Top: 60.96,31.75 60.96,34.29 64.14,34.29 65.41,33.02 65.13,32.77 64.9,32.59 64.67,32.44 64.41,32.28 64.16,32.16 63.86,32.03 63.47,31.9 63.14,31.83 62.79,31.78 62.48,31.75
N$59
  cutout Top: 66.04,33.66 64.77,34.92 64.77,41.27 66.29,42.8 67.31,42.8 67.31,36.6 67.28,36.3 67.23,35.94 67.18,35.71 67.13,35.53 67.03,35.23 66.95,35.05 66.83,34.77 66.67,34.49 66.52,34.24 66.29,33.93
N$60
  cutout Top: 65.41,43.18 64.14,44.45 57.78,44.45 56.52,43.18 57.78,41.91 64.14,41.91
N$61
  cutout Bottom: 60.96,54.61 60.96,52.07 57.78,52.07 56.52,53.34 56.79,53.59 57.02,53.77 57.25,53.92 57.51,54.08 57.76,54.2 58.06,54.33 58.45,54.46 58.78,54.53 59.13,54.58 59.44,54.61
N$62
  cutout Bottom: 55.88,52.7 57.15,51.44 57.15,45.09 55.63,43.56 54.61,43.56 54.61,49.76 54.64,50.06 54.69,50.42 54.74,50.65 54.79,50.83 54.89,51.13 54.97,51.31 55.09,51.59 55.24,51.87 55.4,52.12 55.63,52.43
N$63
  cutout Bottom: 60.96,54.61 60.96,52.07 64.14,52.07 65.41,53.34 65.13,53.59 64.9,53.77 64.67,53.92 64.41,54.08 64.16,54.2 63.86,54.33 63.47,54.46 63.14,54.53 62.79,54.58 62.48,54.61
N$64
  cutout Bottom: 66.04,52.7 64.77,51.44 64.77,45.09 66.29,43.56 67.31,43.56 67.31,49.76 67.28,50.06 67.23,50.42 67.18,50.65 67.13,50.83 67.03,51.13 66.95,51.31 66.83,51.59 66.67,51.87 66.52,52.12 66.29,52.43
N$65
  cutout Bottom: 60.96,31.75 60.96,34.29 57.78,34.29 56.52,33.02 56.79,32.77 57.02,32.59 57.25,32.44 57.51,32.28 57.76,32.16 58.06,32.03 58.45,31.9 58.78,31.83 59.13,31.78 59.44,31.75
N$66
  cutout Bottom: 55.88,33.66 57.15,34.92 57.15,41.27 55.63,42.8 54.61,42.8 54.61,36.6 54.64,36.3 54.69,35.94 54.74,35.71 54.79,35.53 54.89,35.23 54.97,35.05 55.09,34.77 55.24,34.49 55.4,34.24 55.63,33.93
N$67
  cutout Bottom: 60.96,31.75 60.96,34.29 64.14,34.29 65.41,33.02 65.13,32.77 64.9,32.59 64.67,32.44 64.41,32.28 64.16,32.16 63.86,32.03 63.47,31.9 63.14,31.83 62.79,31.78 62.48,31.75
N$68
  cutout Bottom: 66.04,33.66 64.77,34.92 64.77,41.27 66.29,42.8 67.31,42.8 67.31,36.6 67.28,36.3 67.23,35.94 67.18,35.71 67.13,35.53 67.03,35.23 66.95,35.05 66.83,34.77 66.67,34.49 66.52,34.24 66.29,33.93
N$69
  cutout Bottom: 65.41,43.18 64.14,44.45 57.78,44.45 56.52,43.18 57.78,41.91 64.14,41.91
N$70
  cutout Top: 43.18,54.61 43.18,52.07 40.01,52.07 38.73,53.34 39.01,53.59 39.24,53.77 39.47,53.92 39.73,54.08 39.98,54.2 40.28,54.33 40.67,54.46 41,54.53 41.35,54.58 41.66,54.61
N$71
  cutout Top: 38.1,52.7 39.37,51.44 39.37,45.09 37.85,43.56 36.83,43.56 36.83,49.76 36.86,50.06 36.91,50.42 36.96,50.65 37.01,50.83 37.11,51.13 37.19,51.31 37.31,51.59 37.47,51.87 37.62,52.12 37.85,52.43
N$72
  cutout Top: 43.18,54.61 43.18,52.07 46.35,52.07 47.62,53.34 47.35,53.59 47.12,53.77 46.89,53.92 46.63,54.08 46.38,54.2 46.08,54.33 45.69,54.46 45.36,54.53 45.01,54.58 44.7,54.61
N$73
  cutout Top: 48.26,52.7 46.99,51.44 46.99,45.09 48.51,43.56 49.53,43.56 49.53,49.76 49.5,50.06 49.45,50.42 49.4,50.65 49.35,50.83 49.25,51.13 49.17,51.31 49.05,51.59 48.9,51.87 48.74,52.12 48.51,52.43
N$74
  cutout Top: 43.18,31.75 43.18,34.29 40.01,34.29 38.73,33.02 39.01,32.77 39.24,32.59 39.47,32.44 39.73,32.28 39.98,32.16 40.28,32.03 40.67,31.9 41,31.83 41.35,31.78 41.66,31.75
N$75
  cutout Top: 38.1,33.66 39.37,34.92 39.37,41.27 37.85,42.8 36.83,42.8 36.83,36.6 36.86,36.3 36.91,35.94 36.96,35.71 37.01,35.53 37.11,35.23 37.19,35.05 37.31,34.77 37.47,34.49 37.62,34.24 37.85,33.93
N$76
  cutout Top: 43.18,31.75 43.18,34.29 46.35,34.29 47.62,33.02 47.35,32.77 47.12,32.59 46.89,32.44 46.63,32.28 46.38,32.16 46.08,32.03 45.69,31.9 45.36,31.83 45.01,31.78 44.7,31.75
N$77
  cutout Top: 48.26,33.66 46.99,34.92 46.99,41.27 48.51,42.8 49.53,42.8 49.53,36.6 49.5,36.3 49.45,35.94 49.4,35.71 49.35,35.53 49.25,35.23 49.17,35.05 49.05,34.77 48.9,34.49 48.74,34.24 48.51,33.93
N$78
  cutout Top: 47.62,43.18 46.35,44.45 40.01,44.45 38.73,43.18 40.01,41.91 46.35,41.91
N$79
  cutout Bottom: 43.18,54.61 43.18,52.07 40.01,52.07 38.73,53.34 39.01,53.59 39.24,53.77 39.47,53.92 39.73,54.08 39.98,54.2 40.28,54.33 40.67,54.46 41,54.53 41.35,54.58 41.66,54.61
N$80
  cutout Bottom: 38.1,52.7 39.37,51.44 39.37,45.09 37.85,43.56 36.83,43.56 36.83,49.76 36.86,50.06 36.91,50.42 36.96,50.65 37.01,50.83 37.11,51.13 37.19,51.31 37.31,51.59 37.47,51.87 37.62,52.12 37.85,52.43
N$81
  cutout Bottom: 43.18,54.61 43.18,52.07 46.35,52.07 47.62,53.34 47.35,53.59 47.12,53.77 46.89,53.92 46.63,54.08 46.38,54.2 46.08,54.33 45.69,54.46 45.36,54.53 45.01,54.58 44.7,54.61
N$82
  cutout Bottom: 48.26,52.7 46.99,51.44 46.99,45.09 48.51,43.56 49.53,43.56 49.53,49.76 49.5,50.06 49.45,50.42 49.4,50.65 49.35,50.83 49.25,51.13 49.17,51.31 49.05,51.59 48.9,51.87 48.74,52.12 48.51,52.43
N$83
  cutout Bottom: 43.18,31.75 43.18,34.29 40.01,34.29 38.73,33.02 39.01,32.77 39.24,32.59 39.47,32.44 39.73,32.28 39.98,32.16 40.28,32.03 40.67,31.9 41,31.83 41.35,31.78 41.66,31.75
N$84
  cutout Bottom: 38.1,33.66 39.37,34.92 39.37,41.27 37.85,42.8 36.83,42.8 36.83,36.6 36.86,36.3 36.91,35.94 36.96,35.71 37.01,35.53 37.11,35.23 37.19,35.05 37.31,34.77 37.47,34.49 37.62,34.24 37.85,33.93
N$85
  cutout Bottom: 43.18,31.75 43.18,34.29 46.35,34.29 47.62,33.02 47.35,32.77 47.12,32.59 46.89,32.44 46.63,32.28 46.38,32.16 46.08,32.03 45.69,31.9 45.36,31.83 45.01,31.78 44.7,31.75
N$86
  cutout Bottom: 48.26,33.66 46.99,34.92 46.99,41.27 48.51,42.8 49.53,42.8 49.53,36.6 49.5,36.3 49.45,35.94 49.4,35.71 49.35,35.53 49.25,35.23 49.17,35.05 49.05,34.77 48.9,34.49 48.74,34.24 48.51,33.93
N$87
  cutout Bottom: 47.62,43.18 46.35,44.45 40.01,44.45 38.73,43.18 40.01,41.91 46.35,41.91
N$88
  cutout Top: 25.4,54.61 25.4,52.07 22.23,52.07 20.95,53.34 21.23,53.59 21.46,53.77 21.69,53.92 21.95,54.08 22.2,54.2 22.5,54.33 22.89,54.46 23.22,54.53 23.57,54.58 23.88,54.61
N$89
  cutout Top: 20.32,52.7 21.59,51.44 21.59,45.09 20.07,43.56 19.05,43.56 19.05,49.76 19.08,50.06 19.13,50.42 19.18,50.65 19.23,50.83 19.33,51.13 19.41,51.31 19.53,51.59 19.68,51.87 19.84,52.12 20.07,52.43
N$90
  cutout Top: 25.4,54.61 25.4,52.07 28.57,52.07 29.84,53.34 29.57,53.59 29.34,53.77 29.11,53.92 28.85,54.08 28.6,54.2 28.3,54.33 27.91,54.46 27.58,54.53 27.23,54.58 26.92,54.61
N$91
  cutout Top: 30.48,52.7 29.21,51.44 29.21,45.09 30.73,43.56 31.75,43.56 31.75,49.76 31.72,50.06 31.67,50.42 31.62,50.65 31.57,50.83 31.47,51.13 31.39,51.31 31.27,51.59 31.11,51.87 30.96,52.12 30.73,52.43
N$92
  cutout Top: 25.4,31.75 25.4,34.29 22.23,34.29 20.95,33.02 21.23,32.77 21.46,32.59 21.69,32.44 21.95,32.28 22.2,32.16 22.5,32.03 22.89,31.9 23.22,31.83 23.57,31.78 23.88,31.75
N$93
  cutout Top: 20.32,33.66 21.59,34.92 21.59,41.27 20.07,42.8 19.05,42.8 19.05,36.6 19.08,36.3 19.13,35.94 19.18,35.71 19.23,35.53 19.33,35.23 19.41,35.05 19.53,34.77 19.68,34.49 19.84,34.24 20.07,33.93
N$94
  cutout Top: 25.4,31.75 25.4,34.29 28.57,34.29 29.84,33.02 29.57,32.77 29.34,32.59 29.11,32.44 28.85,32.28 28.6,32.16 28.3,32.03 27.91,31.9 27.58,31.83 27.23,31.78 26.92,31.75
N$95
  cutout Top: 30.48,33.66 29.21,34.92 29.21,41.27 30.73,42.8 31.75,42.8 31.75,36.6 31.72,36.3 31.67,35.94 31.62,35.71 31.57,35.53 31.47,35.23 31.39,35.05 31.27,34.77 31.11,34.49 30.96,34.24 30.73,33.93
N$96
  cutout Top: 29.84,43.18 28.57,44.45 22.23,44.45 20.95,43.18 22.23,41.91 28.57,41.91
N$97
  cutout Bottom: 25.4,54.61 25.4,52.07 22.23,52.07 20.95,53.34 21.23,53.59 21.46,53.77 21.69,53.92 21.95,54.08 22.2,54.2 22.5,54.33 22.89,54.46 23.22,54.53 23.57,54.58 23.88,54.61
N$98
  cutout Bottom: 20.32,52.7 21.59,51.44 21.59,45.09 20.07,43.56 19.05,43.56 19.05,49.76 19.08,50.06 19.13,50.42 19.18,50.65 19.23,50.83 19.33,51.13 19.41,51.31 19.53,51.59 19.68,51.87 19.84,52.12 20.07,52.43
N$99
  cutout Bottom: 25.4,54.61 25.4,52.07 28.57,52.07 29.84,53.34 29.57,53.59 29.34,53.77 29.11,53.92 28.85,54.08 28.6,54.2 28.3,54.33 27.91,54.46 27.58,54.53 27.23,54.58 26.92,54.61
N$100
  cutout Bottom: 30.48,52.7 29.21,51.44 29.21,45.09 30.73,43.56 31.75,43.56 31.75,49.76 31.72,50.06 31.67,50.42 31.62,50.65 31.57,50.83 31.47,51.13 31.39,51.31 31.27,51.59 31.11,51.87 30.96,52.12 30.73,52.43
N$101
  cutout Bottom: 25.4,31.75 25.4,34.29 22.23,34.29 20.95,33.02 21.23,32.77 21.46,32.59 21.69,32.44 21.95,32.28 22.2,32.16 22.5,32.03 22.89,31.9 23.22,31.83 23.57,31.78 23.88,31.75
N$102
  cutout Bottom: 20.32,33.66 21.59,34.92 21.59,41.27 20.07,42.8 19.05,42.8 19.05,36.6 19.08,36.3 19.13,35.94 19.18,35.71 19.23,35.53 19.33,35.23 19.41,35.05 19.53,34.77 19.68,34.49 19.84,34.24 20.07,33.93
N$103
  cutout Bottom: 25.4,31.75 25.4,34.29 28.57,34.29 29.84,33.02 29.57,32.77 29.34,32.59 29.11,32.44 28.85,32.28 28.6,32.16 28.3,32.03 27.91,31.9 27.58,31.83 27.23,31.78 26.92,31.75
N$104
  cutout Bottom: 30.48,33.66 29.21,34.92 29.21,41.27 30.73,42.8 31.75,42.8 31.75,36.6 31.72,36.3 31.67,35.94 31.62,35.71 31.57,35.53 31.47,35.23 31.39,35.05 31.27,34.77 31.11,34.49 30.96,34.24 30.73,33.93
N$105
  cutout Bottom: 29.84,43.18 28.57,44.45 22.23,44.45 20.95,43.18 22.23,41.91 28.57,41.91
SEG1
  Bottom 0.152: R2.2 D1S1.A 61.84,23.76 61.47,24.13 44.07,24.13 | 44.07,24.13 26.67,24.13 26.28,23.74 D3S1.A | D2S1.A 44.06,24.12 44.07,24.13
SEG2
  Bottom 0.152: R3.2 67.44,21.59 | 67.44,21.59 65.53,21.59 64.77,20.83 49.4,20.83 | 49.4,20.83 32.26,20.83 31.75,20.32 31.75,17.27 31.37,16.89 30.49,16.89 D3S2.A | D1S2.A 66.94,16.9 67.44,17.4 67.44,21.59 | D2S2.A 48.91,16.9 49.53,17.53 49.53,20.7 49.4,20.83
SEG3
  Bottom 0.152: R4.2 69.85,20.32 68.58,19.05 68.58,16.51 67.31,15.24 55.88,15.24 | 55.88,15.24 38.1,15.24 | 38.1,15.24 22.86,15.24 21.2,16.9 D3S3.A | DIS3.A 55.88,15.24 | D2S3.A 38.1,15.24
SEG4
  Bottom 0.152: 61.85,14.86 67.44,14.86 68.96,16.38 68.96,18.29 69.72,19.05 R5.2 | 61.85,14.86 44.07,14.86 | 44.07,14.86 27.56,14.86 26.28,13.58 D3S4.A | D2S4.A 44.06,14.85 44.07,14.86 | D1S4.A 61.84,14.85 61.85,14.86
SEG5
  Bottom 0.152: R6.2 69.98,17.78 69.34,17.14 69.34,14.73 66.04,11.43 | 49.53,10.16 64.77,10.16 66.04,11.43 | 49.53,10.16 33.02,10.16 32.38,9.53 32.38,7.62 31.51,6.74 D3S5.A | D2S5.A 49.16,6.74 49.53,7.11 49.53,10.16 | D1S5.A 66.81,6.74 67.31,7.24 67.31,10.16 66.04,11.43
SEG6
  Bottom 0.152: R7.2 70.36,16.51 69.72,15.88 69.72,14.48 67.82,12.57 67.82,5.59 67.31,5.08 55.88,5.08 | 55.88,5.08 38.1,5.08 | 38.1,5.08 20.95,5.08 20.32,5.71 D3S6.A | D2S6.A 38.1,5.08 | D1S6.A 55.88,5.08
SEG7
  Bottom 0.152: R8.2 71.25,15.24 68.33,12.32 68.33,5.46 64.14,1.27 61.85,1.27 | 61.85,1.27 44.07,1.27 | 44.07,1.27 26.67,1.27 26.28,1.66 D3S7.A | D2S7.A 44.06,1.28 44.07,1.27 | D1S7.A 61.84,1.28 61.85,1.27
V_BATT  (via drill 0.38)
  Top 0.152: v88.9,12.95 88.9,12.7 88.9,3.81 J1.2
  Top 0.254: 83.82,19.43 87.25,19.43 88.96,17.72 | 88.9,12.7 88.9,17.65 88.96,17.72 | v80.14,15.75 83.82,19.43 | 83.82,19.43 v83.82,20.32 | 88.96,17.72 89.03,17.78 J9.1
  Bottom 0.152: U1.18 80.41,11.45 C2.1 80.01,10.8 R13.2 | U1.4 v88.9,12.95 | J1.2 89.28,4.19 91.19,4.19 93.68,6.68 D23.A
  Bottom 0.254: S3.1 83.63,20.51 v83.82,20.32 | v80.14,15.75 78.99,15.75 78.11,14.86 78.11,11.43 78.74,10.8 80.01,10.8

### Text on the board
bDocu: NPOOLE